# EAGLE design avr_dip (EAGLE 9.4.2)
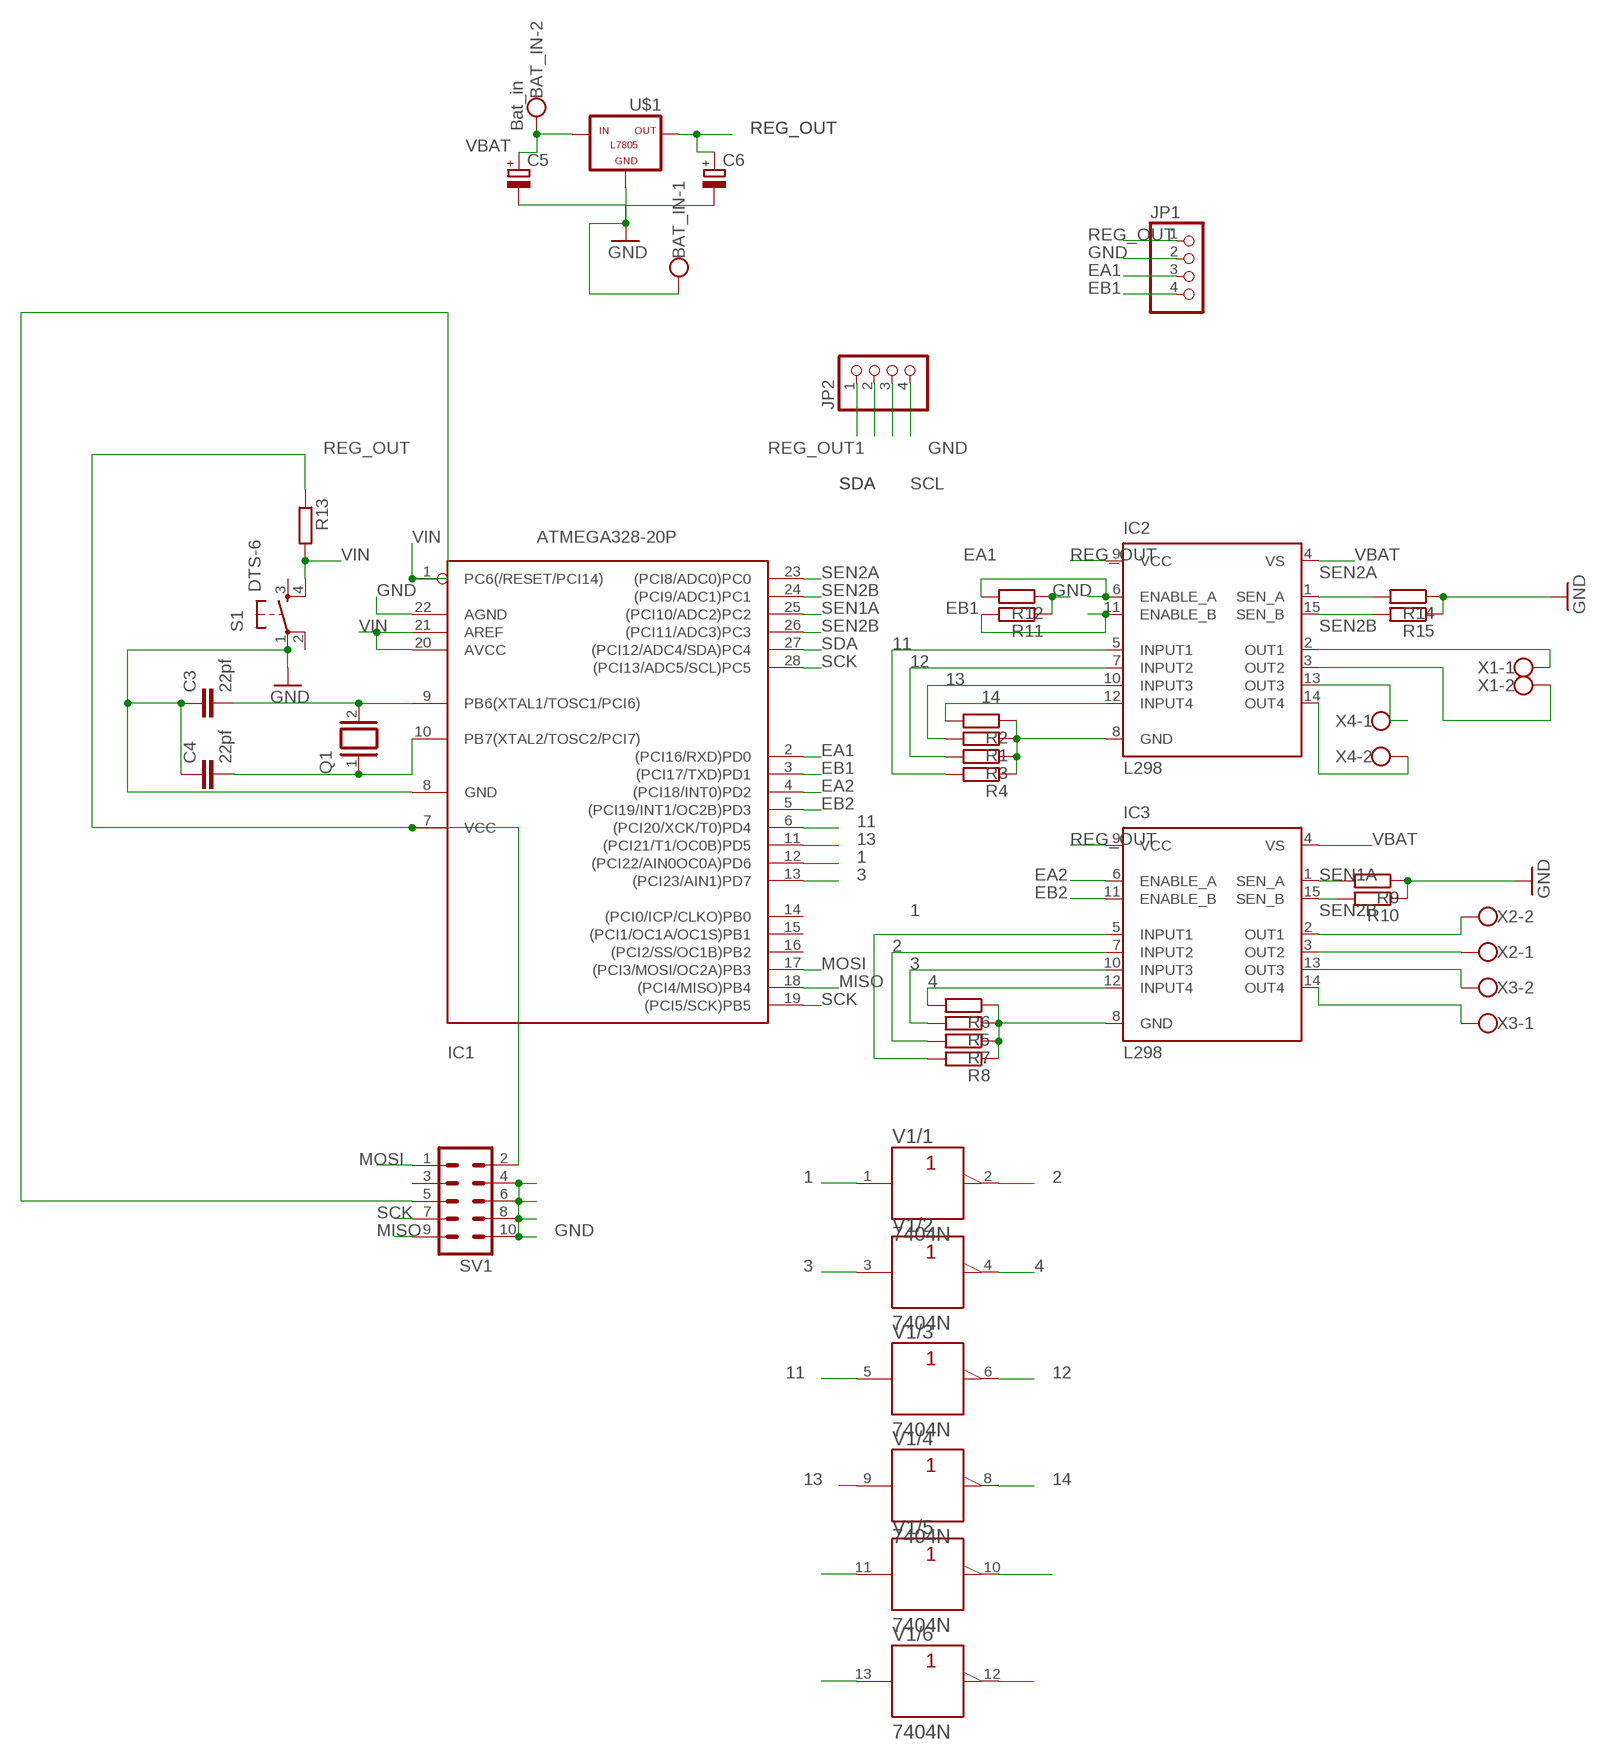
[diagram p0: schematic, sheet 1]

## Parts
BAT_IN  Bat_in  W237-102  [W237-102]
C3  22pf  C5/2.5  [C5B2.5]
C4  22pf  C5/2.5  [C5B2.5]
C5  CPOL-EUE2-5  [E2-5]
C6  CPOL-EUE2-5  [E2-5]
IC1  ATMEGA328-20P  [DIL28-3]
IC2  L298  [MULTIWATT-15]
IC3  L298  [MULTIWATT-15]
JP1  PINHD-1X4  [1X04]
JP2  PINHD-1X4  [1X04]
Q1  XTAL/S  [QS]
R1  R-EU_0207/10  [0207/10]
R2  R-EU_0207/10  [0207/10]
R3  R-EU_0207/10  [0207/10]
R4  R-EU_0207/10  [0207/10]
R5  R-EU_0207/10  [0207/10]
R6  R-EU_0207/10  [0207/10]
R7  R-EU_0207/10  [0207/10]
R8  R-EU_0207/10  [0207/10]
R9  R-EU_0207/10  [0207/10]
R10  R-EU_0207/10  [0207/10]
R11  R-EU_0207/10  [0207/10]
R12  R-EU_0207/10  [0207/10]
R13  R-EU_0207/10  [0207/10]
R14  R-EU_0207/10  [0207/10]
R15  R-EU_0207/10  [0207/10]
S1  DTS-6  [DTS-6]
SV1  MA05-2  [MA05-2]
U$1  -L7805  [L7805]
V1  7404N  [DIL14]
X1  W237-102  [W237-102]
X2  W237-102  [W237-102]
X3  W237-102  [W237-102]
X4  W237-102  [W237-102]

## Nets
1: IC1.12((PCI22/AIN0OC0A)PD6) IC3.5(INPUT1) R8.2 V1.1(/1:A)
2: IC3.7(INPUT2) R7.2 V1.2(/1:Y)
3: IC1.13((PCI23/AIN1)PD7) IC3.10(INPUT3) R5.2 V1.3(/2:A)
4: IC3.12(INPUT4) R6.2 V1.4(/2:Y)
11: IC1.6((PCI20/XCK/T0)PD4) IC2.5(INPUT1) R4.2 V1.5(/3:A)
12: IC2.7(INPUT2) R3.2 V1.6(/3:Y)
13: IC1.11((PCI21/T1/OC0B)PD5) IC2.10(INPUT3) R1.2 V1.9(/4:A)
14: IC2.12(INPUT4) R2.2 V1.8(/4:Y)
EA1: IC1.2((PCI16/RXD)PD0) IC2.6(ENABLE_A) JP1.3 R12.2
EA2: IC1.4((PCI18/INT0)PD2) IC3.6(ENABLE_A)
EB1: IC1.3((PCI17/TXD)PD1) IC2.11(ENABLE_B) JP1.4 R11.2
EB2: IC1.5((PCI19/INT1/OC2B)PD3) IC3.11(ENABLE_B)
GND: BAT_IN.1 C3.1 C4.1 C5.- C6.- IC1.8(GND) IC1.22(AGND) JP1.2 JP2.4 R9.1 R10.1 R11.1 R12.1 R14.1 R15.1 S1.1 SV1.4 SV1.6 SV1.8 SV1.10 U$1.GND
MISO: IC1.18((PCI4/MISO)PB4) SV1.9
MOSI: IC1.17((PCI3/MOSI/OC2A)PB3) SV1.1
N$1: IC2.13(OUT3) X4.1
N$2: C3.2 IC1.9(PB6(XTAL1/TOSC1/PCI6)) Q1.2
N$3: C4.2 IC1.10(PB7(XTAL2/TOSC2/PCI7)) Q1.1
N$5: IC2.8(GND) R1.1 R2.1 R3.1 R4.1
N$8: IC2.14(OUT4) X4.2
N$9: IC2.2(OUT1) X1.1
N$10: IC2.3(OUT2) X1.2
N$11: IC3.2(OUT1) X2.2
N$12: IC3.8(GND) R5.1 R6.1 R7.1 R8.1
N$13: IC3.3(OUT2) X2.1
N$14: IC3.13(OUT3) X3.2
N$15: IC3.14(OUT4) X3.1
N$24: V1.11(/5:A)
N$25: V1.10(/5:Y)
N$26: V1.13(/6:A)
N$27: V1.12(/6:Y)
REG_OUT: C6.+ IC1.7(VCC) IC2.9(VCC) IC3.9(VCC) JP1.1 R13.1 SV1.2 U$1.OUT
REG_OUT1: JP2.1
SCK: IC1.19((PCI5/SCK)PB5) IC1.28((PCI13/ADC5/SCL)PC5) SV1.7
SCL: JP2.3
SDA: IC1.27((PCI12/ADC4/SDA)PC4) JP2.2
SEN1A: IC1.25((PCI10/ADC2)PC2) IC3.1(SEN_A) R9.2
SEN2A: IC1.23((PCI8/ADC0)PC0) IC2.1(SEN_A) R14.2
SEN2B: IC1.24((PCI9/ADC1)PC1) IC1.26((PCI11/ADC3)PC3) IC2.15(SEN_B) IC3.15(SEN_B) R10.2 R15.2
VBAT: BAT_IN.2 C5.+ IC2.4(VS) IC3.4(VS) U$1.IN
VIN: IC1.1(PC6(/RESET/PCI14)) IC1.20(AVCC) IC1.21(AREF) R13.2 S1.4 SV1.5
Unconnected: IC1.14((PCI0/ICP/CLKO)PB0) IC1.15((PCI1/OC1A/OC1S)PB1) IC1.16((PCI2/SS/OC1B)PB2) S1.2 S1.3 SV1.3

## Power pins joined to a net without a drawn wire
+UB: V1.14(/+UB:+UB)
-UB: V1.7(/-UB:-UB)

## Library data of the parts
BAT_IN X1-X4 = con-wago-500:W237-102: WAGO SCREW CLAMP; MPN: 237-102; OC_FARNELL: unknown; OC_NEWARK: 70K9898
C3 C4 = capacitor-wima:C: CAPACITOR naming: grid - package width
C5 C6 = rcl:CPOL-EU: POLARIZED CAPACITOR, European symbol; SPICEPREFIX: C
IC1 = atmega328:ATMEGA328*P: MICROCONTROLLER 32 kBytes FLASH 2 kBytes SRAM 1 kBytes EEPROM USART 8-channel 10 bit ADC
IC2 IC3 = st-microelectronics:L298: DUAL FULL-BRIDGE DRIVER; MPN: L298N; OC_FARNELL: 1589425; OC_NEWARK: 32M1527
JP1 JP2 = pinhead:PINHD-1X4: PIN HEADER
Q1 = special:XTAL/S: CRYSTAL
R1-R15 = rcl:R-EU_: RESISTOR, European symbol; SPICEPREFIX: R
S1 = switch-tact (1):DTS-6
SV1 = con-lstb:MA05-2: PIN HEADER; OC_FARNELL: unknown; OC_NEWARK: unknown
U$1 = tango:-L7805
V1 = 74ttl-din:74*04: Hex INVERTER

## Board
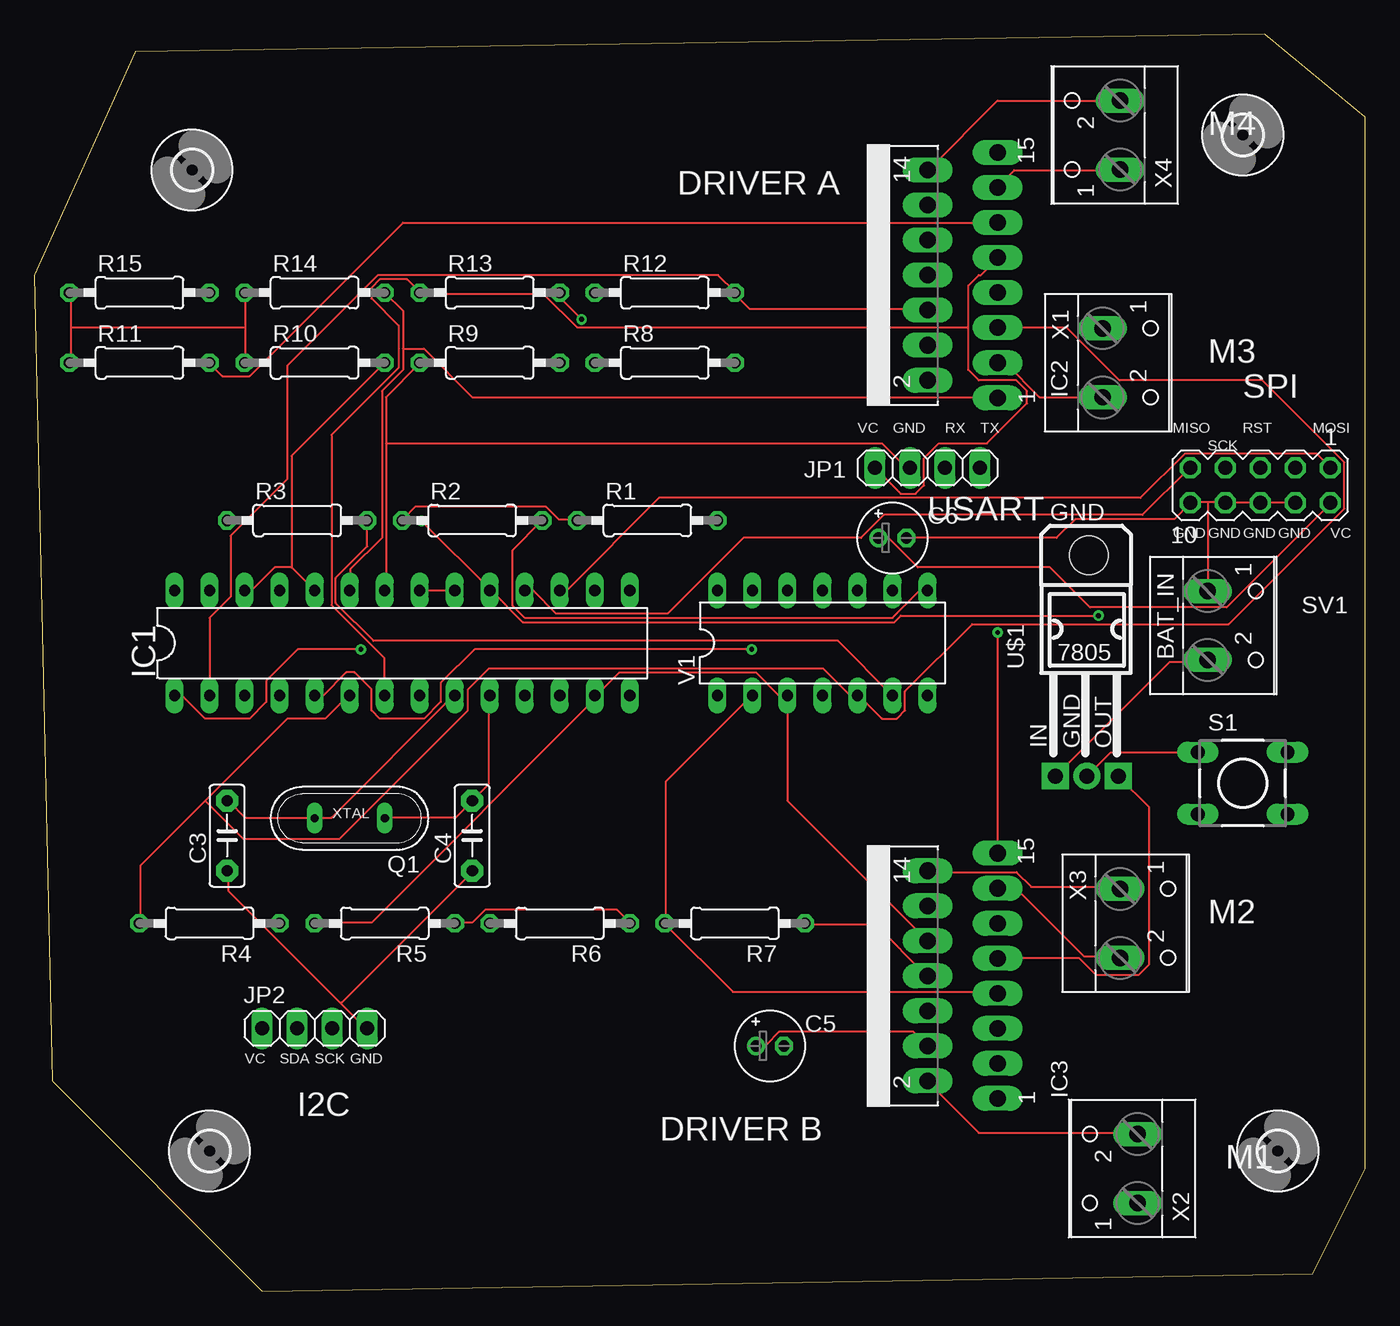
[diagram p1: board, top side]
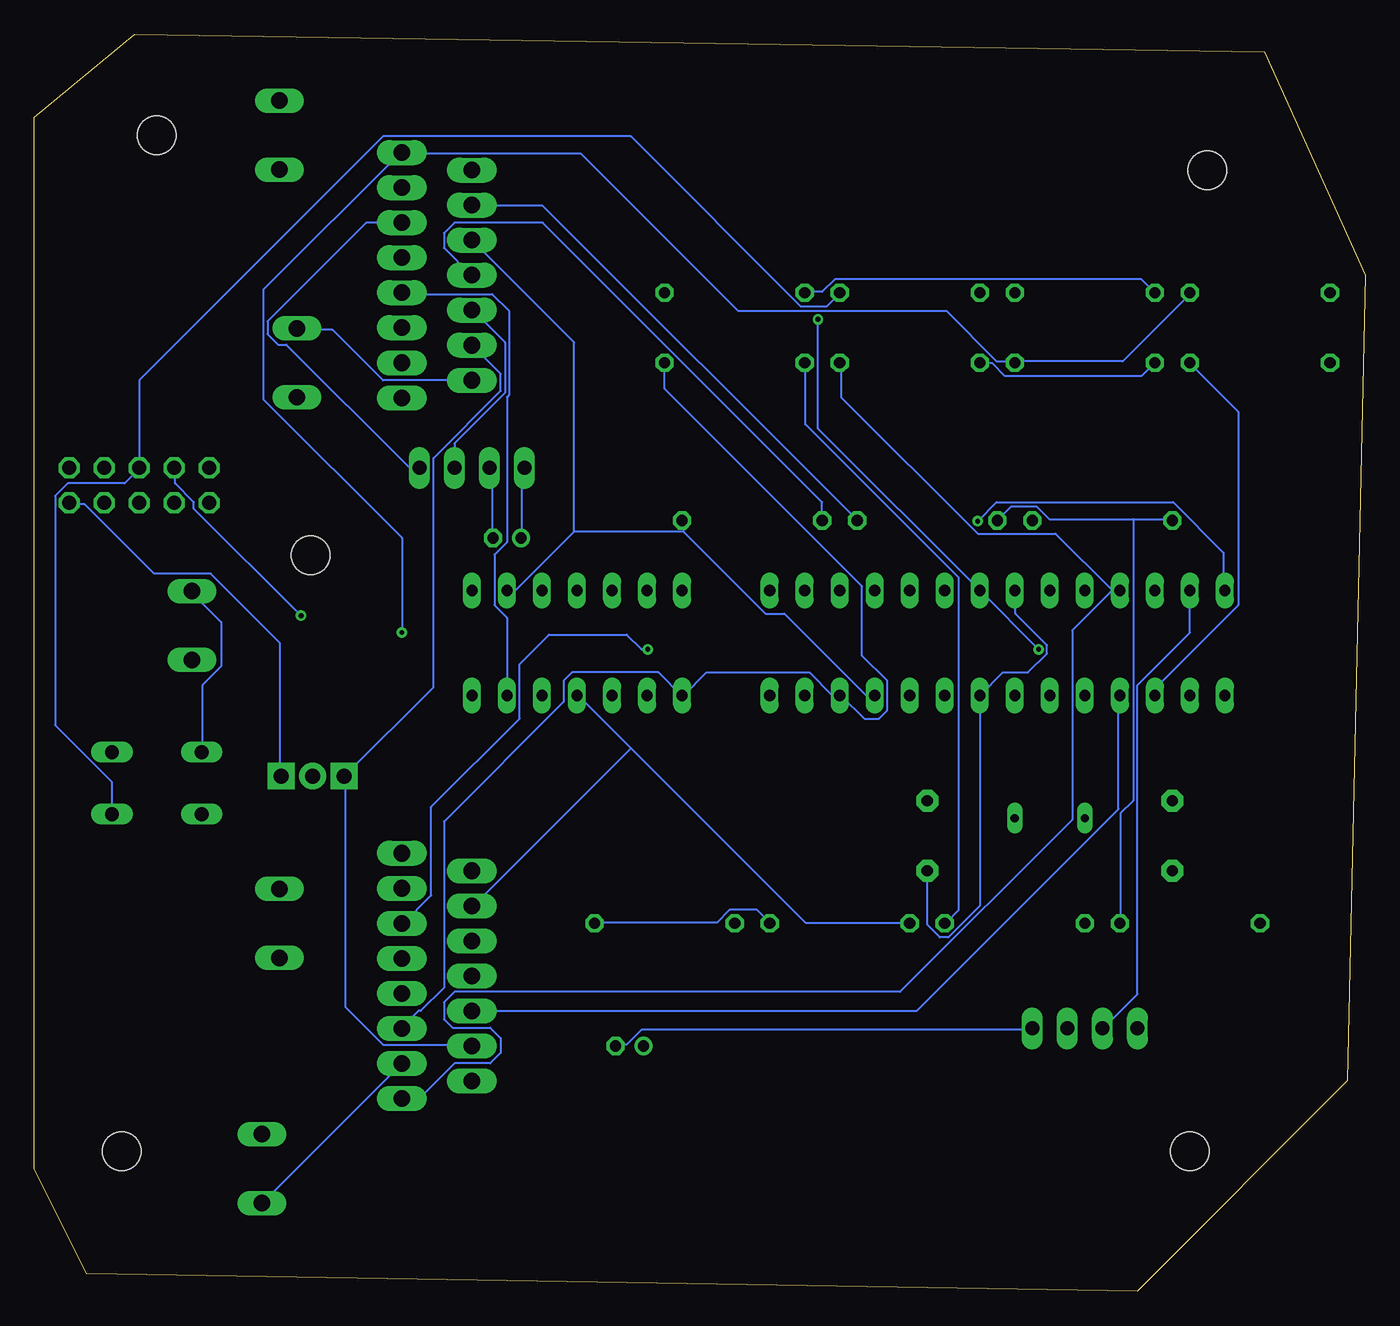
[diagram p2: board, bottom side, seen from below]

Size 96.5 x 91.11 mm. Coordinates in mm from the lower left corner, seen from the top.
Outline: 0,73.66 1.27,15.24 16.51,0 92.71,1.27 96.5,8.87 96.5,85.11 89.23,91.11 7.29,89.84 0,73.66
Copper layers (1*16): Top 0.035mm / dielectric 1.5mm / Bottom 0.035mm
Design rules "default": minimum track width 6mil, minimum drill 0.35mm, track to track 6mil, track to pad 6mil, pad to pad 6mil, via to via 6mil, smd to smd 6mil, copper to edge 40mil, drill to drill 6mil, minimum pad ring 10mil, minimum via ring 8mil, stop-mask expansion 4mil, vias tented up to drill 0mil, thermal gap 10mil

### Footprints (pad centres in the part's own frame; a part is rotated, then mirrored left to right if it is on the bottom)
W237-102 = drill 1.194 long: 1 -2.5,-1.27; 2 2.5,-1.27
C5B2.5 = drill 0.813 pad 1.6 octagon: 1 -2.54,0; 2 2.54,0
E2-5 = drill 0.813 pad 1.27: + -1.016,0 | drill 0.813 pad 1.27 octagon: - 1.016,0
DIL28-3 = drill 0.813 long: 1 -16.51,-3.81; 2 -13.97,-3.81; 3 -11.43,-3.81; 4 -8.89,-3.81; 5 -6.35,-3.81; 6 -3.81,-3.81; 7 -1.27,-3.81; 8 1.27,-3.81; 9 3.81,-3.81; 10 6.35,-3.81; 11 8.89,-3.81; 12 11.43,-3.81; 13 13.97,-3.81; 14 16.51,-3.81; 15 16.51,3.81; 16 13.97,3.81; 17 11.43,3.81; 18 8.89,3.81; 19 6.35,3.81; 20 3.81,3.81; 21 1.27,3.81; 22 -1.27,3.81; 23 -3.81,3.81; 24 -6.35,3.81; 25 -8.89,3.81; 26 -11.43,3.81; 27 -13.97,3.81; 28 -16.51,3.81
MULTIWATT-15 = drill 1.2 long: 1 -8.89,-7.62; 2 -7.62,-2.54; 3 -6.35,-7.62; 4 -5.08,-2.54; 5 -3.81,-7.62; 6 -2.54,-2.54; 7 -1.27,-7.62; 8 0,-2.54; 9 1.27,-7.62; 10 2.54,-2.54; 11 3.81,-7.62; 12 5.08,-2.54; 13 6.35,-7.62; 14 7.62,-2.54; 15 8.89,-7.62
1X04 = drill 1.016 long: 1 -3.81,0; 2 -1.27,0; 3 1.27,0; 4 3.81,0
QS = drill 0.61 long: 1 -2.54,0; 2 2.54,0
0207/10 = drill 0.813 octagon: 1 -5.08,0; 2 5.08,0
DTS-6 = drill 1 long: 1 -3.25,2.25; 2 3.25,2.25; 3 -3.25,-2.25; 4 3.25,-2.25
MA05-2 = drill 1.016 octagon: 1 -5.08,-1.27; 2 -5.08,1.27; 3 -2.54,-1.27; 4 -2.54,1.27; 5 0,-1.27; 6 0,1.27; 7 2.54,-1.27; 8 2.54,1.27; 9 5.08,-1.27; 10 5.08,1.27
L7805 = drill 1.1 pad 1.93: GND 0.127,-9.652 | drill 1.1 pad 1.93 square: IN -2.159,-9.652; OUT 2.413,-9.652 | hole 2.8: 0.254,6.35
2,8 = hole 2.8: 0,0
DIL14 = drill 0.813 long: 1 -7.62,-3.81; 2 -5.08,-3.81; 3 -2.54,-3.81; 4 0,-3.81; 5 2.54,-3.81; 6 5.08,-3.81; 7 7.62,-3.81; 8 7.62,3.81; 9 5.08,3.81; 10 2.54,3.81; 11 0,3.81; 12 -2.54,3.81; 13 -5.08,3.81; 14 -7.62,3.81

### Placement (x,y rotation side)
BAT_IN  86.36,48.26 270 top
C3  13.97,33.02 90 top
C4  31.75,33.02 90 top
C5  53.34,17.78 0 top
C6  62.23,54.61 0 top
IC1  26.67,46.99 0 top
IC2  62.23,73.66 90 top
IC3  62.23,22.86 90 top
JP1  64.77,59.69 0 top
JP2  20.32,19.05 0 top
Q1  22.86,34.29 180 top
R1  44.45,55.88 0 top
R2  31.75,55.88 0 top
R3  19.05,55.88 0 top
R4  12.7,26.67 180 top
R5  25.4,26.67 180 top
R6  38.1,26.67 180 top
R7  50.8,26.67 180 top
R8  45.72,67.31 0 top
R9  33.02,67.31 0 top
R10  20.32,67.31 0 top
R11  7.62,67.31 0 top
R12  45.72,72.39 0 top
R13  33.02,72.39 0 top
R14  20.32,72.39 0 top
R15  7.62,72.39 0 top
S1  87.63,36.83 0 top
SV1  88.9,58.42 180 top
U$1  76.2,46.99 0 top
U$2  [2,8]  11.43,81.28 0 top
U$3  [2,8]  12.7,10.16 0 top
U$4  [2,8]  87.63,83.82 0 top
U$5  [2,8]  90.17,10.16 0 top
V1  57.15,46.99 0 top
X1  78.74,67.31 270 top
X2  78.74,8.89 90 top
X3  80.01,26.67 270 top
X4  77.47,83.82 90 top

### Tracks (layer width: path | path; a pad name or v marks a point on that pad's centre or on a via)
1
  Bottom 0.152: R8.2 50.8,65.43 36.47,51.1 36.47,46.08 34.65,44.25 34.65,42.11 35.25,41.5 36.32,41.5 38,43.18 IC1.12 38.61,43.18 40.28,44.86 47.75,44.86 49.43,43.18 V1.1 49.58,43.18 51.26,44.86 57.51,44.86 58.12,44.25 58.12,42.72 66.8,34.04 66.8,22 68.48,20.32 68.63,20.32 69.85,19.1 IC3.5
2
  Top 0.152: V1.2 52.02,43.18 45.77,36.93 45.77,26.72 R7.2 45.77,26.57 50.65,21.69 69.85,21.69 IC3.7
3
  Top 0.152: R5.2 20.32,26.72 24.44,26.72 40.59,42.88 40.59,43.18 IC1.13 40.74,43.18 42.42,44.86 52.32,44.86 54,43.18 V1.3 54.61,35.56 IC3.10
4
  Bottom 0.152: 53.24,39.37 57.05,43.18 V1.4 | 53.24,39.37 40.59,26.72 33.12,26.72 R6.2 | 53.24,39.37 64.67,27.94 IC3.12
11
  Top 0.152: 12.39,35.56 18.34,41.5 21.08,41.5 22.76,43.18 IC1.6 | 12.39,35.56 7.67,30.84 7.67,26.72 R4.2 | 12.39,35.56 15.14,32.82 22.15,32.82 31.45,42.11 31.45,43.64 32.97,45.16 57.2,45.16 59.18,43.18 V1.5 59.79,43.18 61.47,41.5 62.53,41.5 63.14,42.11 63.14,43.48 68.02,48.36 86.61,48.36 95,56.74 95,60.1 89.05,66.04 78.69,66.04 74.88,69.85 IC2.5
12
  Top 0.152: R3.2 24.13,54 21.84,51.71 21.84,49.89 24.59,47.14 58.27,47.14 V1.6
  Bottom 0.152: V1.6 62.23,48.82 63.14,49.73 63.14,53.39 62.23,54.3 62.23,64.82 62.08,64.97 62.08,71.07 63.3,72.29 69.85,72.29 IC2.7
13
  Bottom 0.152: IC1.11 36.17,43.18 42.11,49.12 43.48,49.12 49.43,55.07 | 49.43,55.07 49.43,55.83 R1.2 | V1.9 61.62,50.8 57.35,55.07 | 49.43,55.07 57.35,55.07 | IC2.10 57.35,68.78 57.35,55.07
14
  Top 0.152: V1.8 64.21,50.8 62.23,48.82 35.56,48.82 34.65,49.73 34.65,53.7 R2.2
  Bottom 0.152: R2.2 59.64,78.69 64.67,78.69 IC2.12
EA1
  Top 0.152: IC1.2 12.7,48.82 14.22,50.34 14.22,54.76 18.34,58.88 18.34,67.11 24.89,73.66 49.58,73.66 50.8,72.44 R12.2 50.8,72.29 51.87,71.22 64.67,71.22 IC2.6
  Bottom 0.152: JP1.3 66.04,61.47 62.38,65.13 62.38,68.78 64.67,71.07 IC2.6
EA2
  Bottom 0.152: IC3.6 32.51,20.32 17.88,34.95 17.88,43.18 IC1.4
EB1
  Top 0.152: IC2.11 26.72,77.47 15.6,66.34 13.61,66.34 12.7,67.26 R11.2
  Bottom 0.152: IC2.11 72.44,77.47 79.6,70.31 79.6,69.39 78.84,68.63 78.23,68.63 69.39,59.79 68.63,59.79 JP1.4 | IC1.3 15.14,43.18 15.14,43.79 9.2,49.73 9.2,63.75 12.7,67.26 R11.2
EB2  (via drill 0.35)
  Top 0.152: IC1.5 20.93,43.18 22.61,44.86 23.22,44.86 24.44,43.64 24.44,42.11 25.04,41.5 28.25,41.5 29.46,42.72 29.46,44.09 31.9,46.53 v52.02,46.53
  Bottom 0.152: v52.02,46.53 52.48,46.53 53.54,47.6 59.18,47.6 61.32,45.47 61.32,41.5 67.72,35.1 67.72,28.7 69.85,26.57 IC3.11
GND
  Top 0.152: 22.15,20.93 24.13,18.95 JP2.4 | 22.15,20.93 14.07,29.01 14.07,30.38 C3.1 | 22.15,20.93 22.3,20.93 31.75,30.38 C4.1 | S1.1 84.33,39.06 78.08,39.06 76.4,37.39 U$1.GND | 85.09,57.2 86.31,57.2 SV1.8 86.46,57.2 88.9,57.2 | 85.09,57.2 83.87,57.2 SV1.10 82.65,55.98 75.49,55.98 74.12,54.61 C6.- | 88.9,57.2 91.34,57.2 SV1.4 | 88.9,57.2 SV1.6 | 85.09,57.2 BAT_IN.1 | 2.64,69.85 2.64,72.29 R15.1 | 2.64,69.85 2.64,67.41 R11.1 | 15.29,69.85 15.29,72.29 R14.1 | 15.29,69.85 15.29,67.41 R10.1 | 15.29,69.85 2.64,69.85 | 25.5,61.47 25.5,64.82 27.94,67.26 R9.1 | 25.5,61.47 25.5,50.8 IC1.22 | 25.5,61.47 61.47,61.47 63.14,59.79 63.45,59.79 JP1.2
  Bottom 0.152: C5.- 54.31,17.88 53.54,17.88 52.48,18.95 24.13,18.95 JP2.4 | JP1.2 63.3,59.49 63.3,54.61 C6.- | S1.1 84.33,39.22 84.33,43.94 82.96,45.31 82.96,48.51 85.09,50.65 BAT_IN.1 | IC1.22 25.35,50.8 25.35,49.12 23.06,46.84 23.06,46.23 24.44,44.86 26.26,44.86 IC1.8 27.94,27.94 30.23,25.65 30.84,25.65 31.75,26.57 C4.1 | R10.1 16.2,66.34 26.11,66.34 27.03,67.26 27.94,67.26 R9.1 | R14.1 16.2,73.36 38.46,73.36 39.37,72.44 40.59,72.44 R12.1
MISO
  Top 0.152: IC1.18 36.17,50.8 37.85,49.12 45.92,49.12 51.41,54.61 59.94,54.61 61.62,56.29 80.37,56.29 83.72,59.64 SV1.9
MOSI
  Top 0.152: IC1.17 38.61,50.8 45.31,57.51 80.21,57.51 83.41,60.71 93.02,60.71 93.93,59.79 SV1.1
N$1
  Top 0.152: X4.1 78.69,81.28 71.07,81.28 69.85,80.06 IC2.13
N$2
  Top 0.152: 20.32,34.34 15.29,34.34 14.07,35.56 C3.2 | 20.32,34.34 21.54,34.34 30.38,43.18 IC1.9 | 20.32,34.34 Q1.2
N$3
  Top 0.152: Q1.1 25.5,34.34 30.53,34.34 C4.2 32.97,36.78 32.97,43.18 IC1.10
N$5
  Top 0.152: R1.1 39.37,55.98 38,55.98 37.08,56.9 27.64,56.9 26.72,55.98 R2.1
  Bottom 0.152: 16.81,55.98 22.91,55.98 23.83,56.9 25.65,56.9 R2.1 | 16.81,55.98 14.07,55.98 R3.1 | 16.81,55.98 16.81,35.56 17.73,34.65 17.73,26.72 R4.1 | R1.1 39.37,57.2 59.64,77.47 66.04,77.47 66.8,76.71 66.8,75.64 64.82,73.66 IC2.8
N$8
  Top 0.152: X4.2 78.69,86.31 69.85,86.31 64.82,81.28 IC2.14
N$9
  Bottom 0.152: IC2.2 71.22,66.04 74.88,69.7 77.47,69.7 X1.1
N$10
  Top 0.152: X1.2 77.47,64.82 72.9,64.82 70.46,67.26 69.85,67.26 IC2.3
N$11
  Top 0.152: X2.2 79.91,11.48 68.48,11.48 64.82,15.14 IC3.2
N$12
  Top 0.152: R7.1 55.98,26.57 61.01,26.57 64.67,22.91 IC3.8 | R5.1 30.53,26.72 31.75,26.72 32.66,27.63 42.27,27.63 43.18,26.72 R6.1
  Bottom 0.152: R8.1 40.59,67.26 40.59,62.84 29.46,51.71 29.46,27.63 30.38,26.72 R5.1 | R7.1 55.83,26.72 46.99,26.72 46.08,27.63 44.09,27.63 43.18,26.72 R6.1
N$13
  Bottom 0.152: IC3.3 79.91,6.45 X2.1
N$14
  Top 0.152: X3.2 78.69,24.28 76.1,24.28 71.22,29.16 69.85,29.16 IC3.13
N$15
  Top 0.152: X3.1 78.69,29.31 72.29,29.31 71.22,30.38 64.82,30.38 IC3.14
REG_OUT
  Top 0.152: IC1.7 25.35,43.18 25.35,45.92 21.54,49.73 21.54,62.08 26.42,66.95 26.42,70 24.44,71.98 24.44,72.75 25.04,73.36 27.03,73.36 27.94,72.44 R13.1 27.94,72.29 36.93,72.29 39.37,69.85 67.72,69.85 | 67.72,69.85 67.72,66.8 68.48,66.04 71.22,66.04 71.98,65.28 71.98,64.36 69.09,61.47 65.58,61.47 64.52,60.4 64.52,58.42 63.91,57.81 62.84,57.81 JP1.1 | 67.72,69.85 67.72,72.9 68.48,73.66 68.63,73.66 69.85,74.88 IC2.9 | IC3.9 75.79,24.13 77.01,22.91 80.06,22.91 80.82,23.67 80.82,35.1 78.69,37.24 U$1.OUT | C6.+ 61.92,54.61 64.06,52.48 73.66,52.48 76.56,49.58 86.46,49.58 93.93,57.05 SV1.2
  Bottom 0.152: JP1.1 61.16,59.49 61.16,54.61 C6.+ | SV1.2 93.93,57.05 92.86,57.05 87.83,52.02 83.72,52.02 78.69,46.99 78.69,37.39 U$1.OUT
SCK  (via drill 0.35)
  Top 0.152: 33.12,50.8 v28.09,55.83 | v77.16,48.97 62.84,48.97 62.38,48.51 35.41,48.51 33.12,50.8 | 33.12,50.8 IC1.19
  Bottom 0.152: v28.09,55.83 26.72,57.2 13.92,57.2 10.26,53.54 10.26,50.8 IC1.28 | v77.16,48.97 84.94,56.74 84.94,57.2 86.31,58.57 86.31,59.64 SV1.7
SDA
  Bottom 0.152: IC1.27 12.7,47.75 16.51,43.94 16.51,21.54 18.95,19.1 JP2.2
SEN1A
  Bottom 0.152: 18.34,50.8 IC1.25 17.88,50.8 | 18.34,50.8 22.45,54.91 28.09,54.91 38,64.82 38,67.26 R9.2 | 18.34,50.8 21.23,47.9 21.23,34.19 33.73,21.69 66.04,21.69 66.8,20.93 66.8,19.71 66.19,19.1 63.45,19.1 62.69,18.34 62.69,17.27 63.45,16.51 66.04,16.51 68.48,14.07 69.85,14.07 IC3.1
SEN2A
  Top 0.152: 26.72,68.33 26.72,71.07 R14.2 | 26.72,68.33 26.72,66.8 25.2,65.28 25.2,54.61 22.91,52.32 22.91,50.8 IC1.23 | 26.72,68.33 28.25,68.33 31.75,64.82 69.85,64.82 IC2.1
SEN2B  (via drill 0.35)
  Top 0.152: IC1.26 15.75,50.8 17.42,52.48 18.64,52.48 | IC1.24 18.64,52.48 | 18.64,52.48 18.64,60.55 R10.2 | v69.85,47.75 IC3.15
  Bottom 0.152: R15.2 12.7,72.29 17.58,67.41 25.35,67.41 R10.2 25.5,67.41 26.72,67.41 30.38,71.07 45.47,71.07 56.9,82.5 69.85,82.5 IC2.15 69.85,82.65 79.91,72.59 79.91,64.67 69.85,54.61 v69.85,47.75
VBAT
  Top 0.152: IC3.4 63.75,18.8 54,18.8 53.09,17.88 52.32,17.88 C5.+ | BAT_IN.2 85.09,45.62 82.35,45.62 74.12,37.39 U$1.IN
  Bottom 0.152: IC2.4 62.69,66.5 62.69,65.28 67.56,60.4 67.56,43.79 73.97,37.39 U$1.IN 73.97,37.24 73.97,20.62 71.22,17.88 64.82,17.88 IC3.4
VIN  (via drill 0.35)
  Top 0.152: IC1.1 10.72,43.18 12.39,41.5 15.6,41.5 16.81,42.72 16.81,44.25 19.1,46.53 v23.67,46.53 | IC1.21 IC1.20 | v39.67,70.46 38.15,71.98 38.15,72.29 R13.2
  Bottom 0.152: S1.4 90.88,34.65 90.88,36.93 95,41.05 95,57.66 94.08,58.57 89.97,58.57 88.9,59.64 SV1.5 88.9,66.04 71.22,83.72 53.24,83.72 40.89,71.37 39.06,71.37 38.15,72.29 R13.2 | v23.67,46.53 IC1.21 39.67,62.54 v39.67,70.46

### Text on the board
tPlace: M4 | DRIVER A | M3 | SPI | VC | GND | RX | TX | MISO | RST | MOSI | SCK | USART | GND | GND | GND | GND | VC | XTAL | M2 | VC | SDA | SCK | GND | I2C | DRIVER B | M1